# EAGLE design XTree (EAGLE 9.2.0)
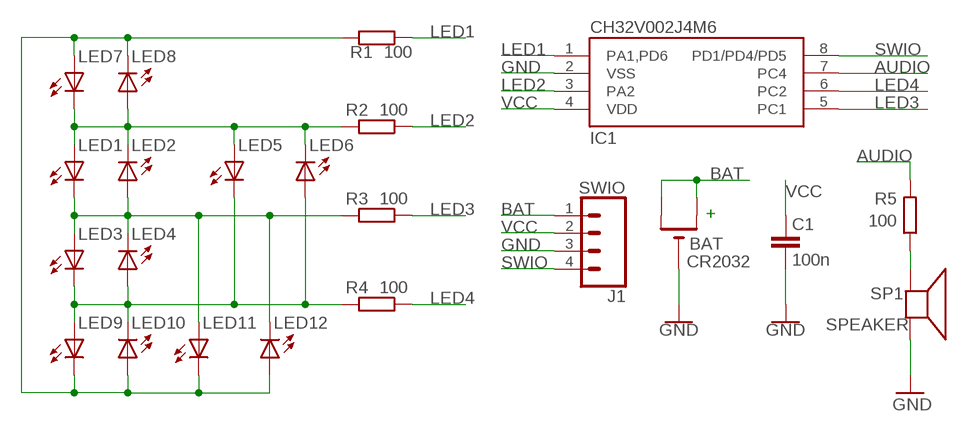
[diagram p0: schematic, sheet 1]

## Parts
BAT  CR2032  CR2032SMT  [CR2032-SMD]
C1  100n  C-EUC1206K  [C1206K]
IC1  CH32V002J4M6  CH32V003J4M6  [SOP8]
J1  SWIO  CONN_04SMD_LONG  [1X04_SMD_LONG]
LED1  LED5MM  [LED5MM]
LED2  LED5MM  [LED5MM]
LED3  LED5MM  [LED5MM]
LED4  LED5MM  [LED5MM]
LED5  LED5MM  [LED5MM]
LED6  LED5MM  [LED5MM]
LED7  LED5MM  [LED5MM]
LED8  LED5MM  [LED5MM]
LED9  LED5MM  [LED5MM]
LED10  LED5MM  [LED5MM]
LED11  LED5MM  [LED5MM]
LED12  LED5MM  [LED5MM]
R1  100  R-EU_M1206  [M1206]
R2  100  R-EU_M1206  [M1206]
R3  100  R-EU_M1206  [M1206]
R4  100  R-EU_M1206  [M1206]
R5  100  R-EU_M1206  [M1206]
SP1  SPEAKER  SPEAKERAL60P_3  [AL60P_3]

## Nets
AUDIO: IC1.7(PC4) R5.2
BAT: BAT.+$1(+) BAT.+$2(+1) J1.1
GND: BAT.- C1.2 IC1.2(VSS) J1.3 SP1.2(-)
LED1: IC1.1(PA1,PD6) R1.1
LED2: IC1.3(PA2) R2.1
LED3: IC1.5(PC1) R3.1
LED4: IC1.6(PC2) R4.1
N$2: R5.1 SP1.1(+)
N$3: LED1.A LED2.K(C) LED5.A LED6.K(C) LED7.K(C) LED8.A R2.2
N$5: LED7.A LED8.K(C) LED9.K(C) LED10.A LED11.K(C) LED12.A R1.2
N$6: LED3.K(C) LED4.A LED5.K(C) LED6.A LED9.A LED10.K(C) R4.2
N$7: LED1.K(C) LED2.A LED3.A LED4.K(C) LED11.A LED12.K(C) R3.2
SWIO: IC1.8(PD1/PD4/PD5) J1.4
VCC: C1.1 IC1.4(VDD) J1.2

## Notes on the sheet
- +

## Library data of the parts
BAT = adafruit:CR2032
C1 = rcl:C-EU: CAPACITOR, European symbol; SPICEPREFIX: C
IC1 = CH32V:CH32V003J4M6
J1 = SparkFun-Connectors:CONN_04: Multi connection point. Often used as Generic Header-pin footprint for 0.1 inch spaced/style header connections On any of the 0.1 inch spaced packages, you can populate with these: Break Away Headers - Straight <https://www.sparkfun.com/products/116> (PRT-00116) Break Away Male Headers - Right Angle <https://www.sparkfun.com/products/553> (PRT-00553) Female Headers <https://www.sparkfun.com/products/115> (PRT-00115) Break Away Headers - Machine Pin <https://www.sparkfun.com/products/117> (PRT-00117) Break Away Female Headers - Swiss Machine Pin <https://www.sparkfun.com/products/743> (PRT-00743) For SCREWTERMINALS and SPRING TERMINALS visit here: Screw Terimnals on SparkFun.com <https://www.sparkfun.com/search/results?term=Screw+Terminals> (5mm/3.5mm/2.54mm spacing) This device is also useful as a general connection point to wire up your design to another part of your project. Our various solder wires solder well into these plated through hole pads. Hook-Up Wire - Assortment (Stranded, 22 AWG) <https://www.sparkfun.com/products/11375> (PRT-11375) Hook-Up Wire - Assortment (Solid Core, 22 AWG) <https://www.sparkfun.com/products/11367> (PRT-11367) View the entire wire category on our website here <https://www.sparkfun.com/categories/141> Special notes: Molex polarized connector foot print use with SKU : PRT-08231 with associated crimp pins and housings. 1MM SMD Version SKU: PRT-10208; PROD_ID: CONN-09140; SF_ID: PRT-12638
LED1-LED12 = adafruit:LED: LED OSRAM: - CHIPLED LG R971, LG N971, LY N971, LG Q971, LY Q971, LO R971, LY R971 LH N974, LH R974 LS Q976, LO Q976, LY Q976 LO Q996 - Hyper CHIPLED LW Q18S LB Q993, LB Q99A, LB R99A - SideLED LS A670, LO A670, LY A670, LG A670, LP A670 LB A673, LV A673, LT A673, LW A673 LH A674 LY A675 LS A676, LA A676, LO A676, LY A676, LW A676 LS A679, LY A679, LG A679 - Hyper Micro SIDELED® LS Y876, LA Y876, LO Y876, LY Y876 LT Y87S - SmartLED LW L88C, LW L88S LB L89C, LB L89S, LG L890 LS L89K, LO L89K, LY L89K LS L896, LA L896, LO L896, LY L896 - TOPLED LS T670, LO T670, LY T670, LG T670, LP T670 LSG T670, LSP T670, LSY T670, LOP T670, LYG T670 LG T671, LOG T671, LSG T671 LB T673, LV T673, LT T673, LW T673 LH T674 LS T676, LA T676, LO T676, LY T676, LB T676, LH T676, LSB T676, LW T676 LB T67C, LV T67C, LT T67C, LS T67K, LO T67K, LY T67K, LW E67C LS E67B, LA E67B, LO E67B, LY E67B, LB E67C, LV E67C, LT E67C LW T67C LS T679, LY T679, LG T679 LS T770, LO T770, LY T770, LG T770, LP T770 LB T773, LV T773, LT T773, LW T773 LH T774 LS E675, LA E675, LY E675, LS T675 LS T776, LA T776, LO T776, LY T776, LB T776 LHGB T686 LT T68C, LB T68C - Hyper Mini TOPLED® LB M676 - Mini TOPLED Santana® LG M470 LS M47K, LO M47K, LY M47K Source: http://www.osram.convergy.de/
R1-R5 = rcl:R-EU_: RESISTOR, European symbol; SPICEPREFIX: R
SP1 = adafruit:SPEAKER: SPEAKER Source: Buerklin Added PS12 (for part # PS1240 piezo) http://www.ladyada.net/library/pcb/eaglelibrary.html

## Board
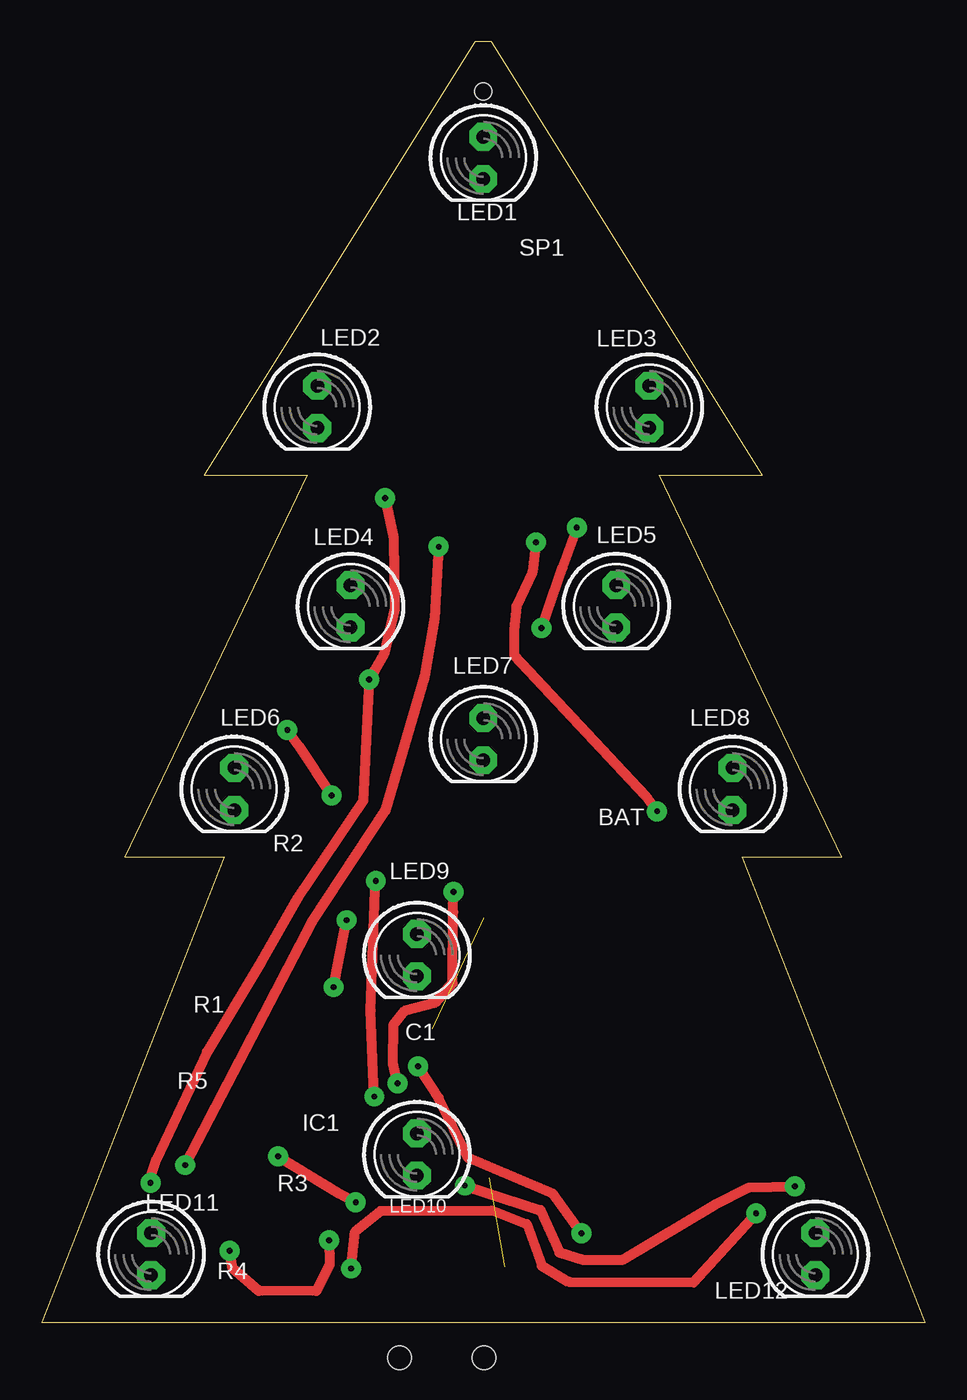
[diagram p1: board, top side]
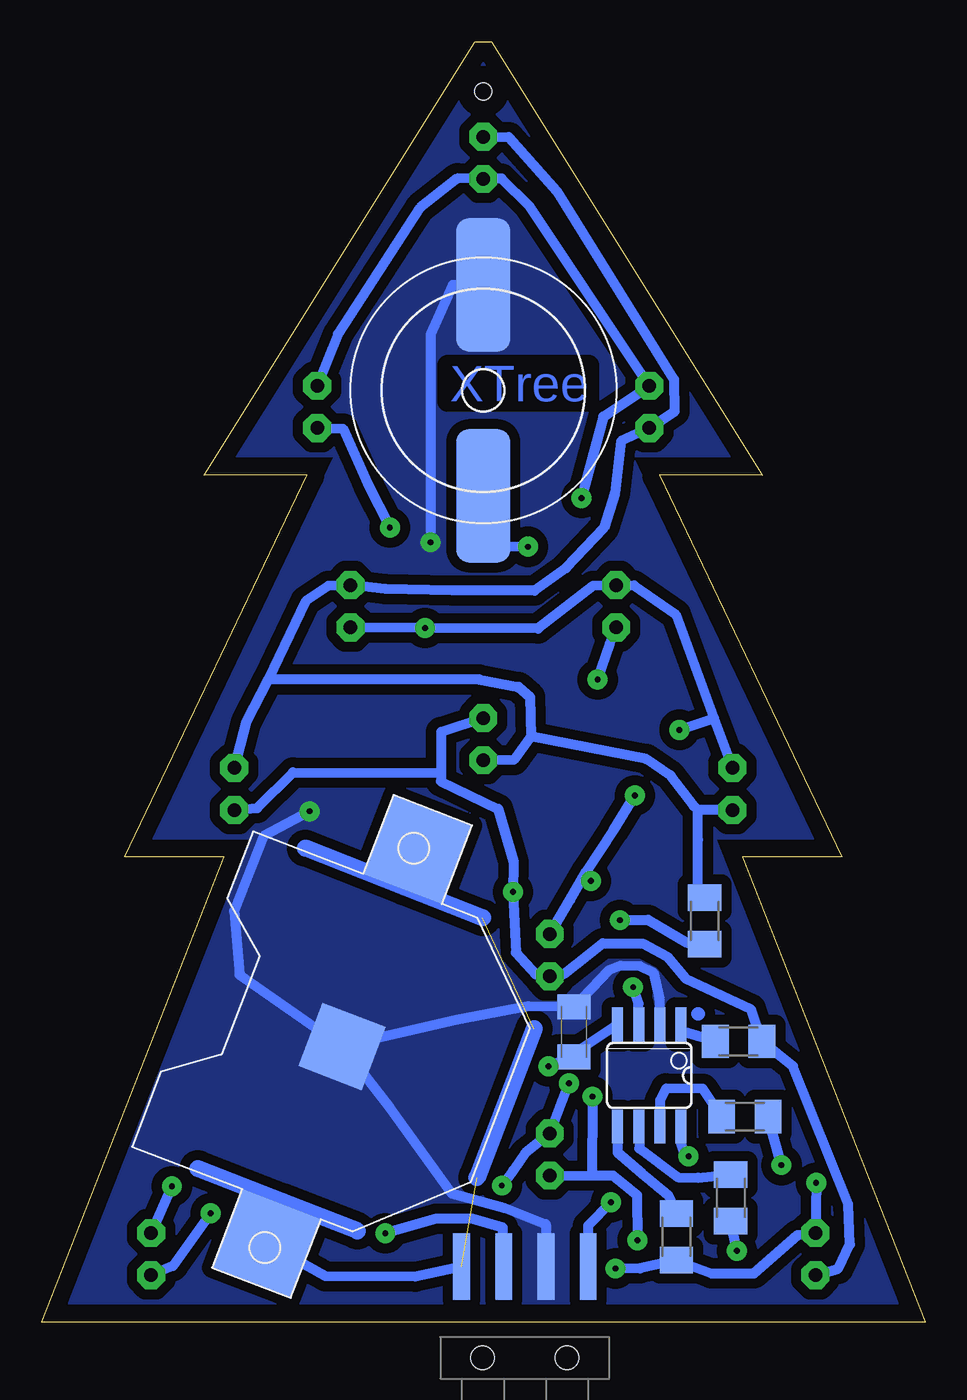
[diagram p2: board, bottom side, seen from below]

Size 53.2 x 77.1 mm. Coordinates in mm from the lower left corner, seen from the top.
Outline: 0,0 53.2,0 42.2,28 48.2,28 37.2,51 43.4,51 27.1,77.1 26.1,77.1 9.8,51 16,51 5,28 11,28 0,0
Copper layers (1*16): Top 0.035mm / dielectric 1.5mm / Bottom 0.035mm
Design rules "default": minimum track width 6mil, minimum drill 0.35mm, track to track 6mil, track to pad 6mil, pad to pad 6mil, via to via 6mil, smd to smd 6mil, copper to edge 40mil, drill to drill 6mil, minimum pad ring 10mil, minimum via ring 8mil, stop-mask expansion 4mil, vias tented up to drill 0mil, thermal gap 10mil
Holes 1 mm at 26.6,74.1

### Footprints (pad centres in the part's own frame; a part is rotated, then mirrored left to right if it is on the bottom)
CR2032-SMD = smd 5.08 x 5.08: +$1 -12.7,0; +$2 12.7,0 | smd 4.064 x 4.064: - 0,0
C1206K = smd 1.5 x 2: 1 -1.5,0; 2 1.5,0
SOP8 = smd 0.66 x 2.032: 1 -1.905,-3.073; 2 -0.635,-3.073; 3 0.635,-3.073; 4 1.905,-3.073; 5 1.905,3.073; 6 0.635,3.073; 7 -0.635,3.073; 8 -1.905,3.073
1X04_SMD_LONG = smd 1 x 4: 1 -3.81,5.5; 2 -1.27,5.5; 3 1.27,5.5; 4 3.81,5.5 | hole 1.4: -2.54,0; 2.54,0
LED5MM = drill 0.813 pad 1.676 octagon: A -1.27,0; K 1.27,0
M1206 = smd 1.6 x 2: 1 -1.4,0; 2 1.4,0
AL60P_3 = smd 8 x 3.251: 1 -6.35,0; 2 6.35,0

### Placement (x,y rotation side)
BAT  35.1,16.6 69 bottom
C1  21.14,17.48 90 bottom
IC1  16.61,14.86 180 bottom
J1  24.1,-2.15 0 bottom
LED1  26.6,70.1 270 top
LED2  16.6,55.1 270 top
LED3  36.6,55.1 270 top
LED4  18.6,43.1 270 top
LED5  34.6,43.1 270 top
LED6  11.6,32.1 270 top
LED7  26.6,35.1 270 top
LED8  41.6,32.1 270 top
LED9  22.6,22.1 270 top
LED10  22.6,10.1 270 top
LED11  6.6,4.1 270 top
LED12  46.6,4.1 270 top
R1  11.23,16.9 0 bottom
R2  13.27,24.15 90 bottom
R3  14.97,5.14 270 bottom
R4  11.7,7.49 270 bottom
R5  10.86,12.38 180 bottom
SP1  26.6,56.1 90 bottom

### Tracks (layer width: path | path; a pad name or v marks a point on that pad's centre or on a via)
AUDIO
  Bottom 0.61: R5.2 13.38,14.06 15.6,14.07 15.95,13.36 IC1.7
BAT  (2 unrouted)
  Bottom 0.61: J1.1 30.7,2.75 36.11,2.77 BAT.+$1
  Bottom 1.016: 34.18,5.5 38.68,7.26 | 38.68,7.26 43.77,9.25 | 26.64,24.35 31.33,26.19 | 31.33,26.19 37.32,28.55 | 23.54,17.67 26.99,8.7 | 38.68,7.26 BAT.+$1 | BAT.+$2 31.33,26.19
GND  (via drill 0.35 pad 1.2)
  Top 0.61: v29.78,46.95 29.55,45.15 28.59,43.11 28.45,41.67 28.45,40.18 36.35,31.71 v37.07,30.76
  Bottom 0.61: SP1.2 28.45,62.44 29.77,59.47 v29.78,46.95 | BAT.- 32.27,12.97 28.5,7.76 25.33,6.89 22.84,5.91 J1.3 | v37.07,30.76 39.83,29.27 41.62,24.76 41.28,20.91 BAT.- | IC1.2 16.01,19.47 16.37,21.06 17.16,21.44 18.34,21.47 19.03,21.2 C1.2 23.91,19.02 28.17,18.21 BAT.-
  pour Bottom (isolate 0.61, no thermals): 1.6,1.1 12.6,29.1 6.6,29.1 17.6,52.1 11.6,52.1 26.6,76.1 41.6,52.1 35.6,52.1 46.6,29.1 40.6,29.1 51.6,1.1
LED1
  Bottom 0.508: 14.57,17.48 IC1.1
  Bottom 0.61: R1.1 14.57,17.48
LED2  (via drill 0.35 pad 1.2)
  Top 0.61: v17.58,20.17 17.78,21.28 v18.37,24.21
  Bottom 0.61: IC1.3 17.26,19.19 v17.58,20.17 | v18.37,24.21 16.67,24.22 14.31,22.85 R2.1
LED3
  Bottom 0.61: IC1.5 18.52,10.22 17.06,8.96 15.48,7.67 R3.1
LED4
  Bottom 0.61: IC1.6 17.21,10.46 14.89,8.73 13.68,8.71 R4.1
N$2  (via drill 0.35 pad 1.2)
  Top 0.61: v23.92,46.69 23.67,42.39 23.06,38.9 20.69,30.78 16.27,24.07 v8.65,9.46
  Bottom 0.61: SP1.1 26.21,46.72 v23.92,46.69 | v8.65,9.46 R5.1
N$3
  Bottom 0.61: LED1.A 25.06,71.35 22.18,68.1 15.12,56.75 15.09,54.84 LED2.K 18.31,53.03 18.68,49.9 19.34,47.81 21.62,45.39 23.51,44.05 28.48,44.05 32.5,44.14 LED5.A 35.94,44.33 37.3,43.41 39.57,38.68 | 39.57,38.68 40.87,36.15 LED8.A | 23.73,35.25 23.78,37.63 24.47,38.25 26.86,38.7 33.13,38.71 39.57,38.68 | 23.73,35.25 24.76,33.86 LED7.K | LED6.K 13.69,30.83 | 13.69,30.83 13.94,31.08 15.33,32.92 16.79,33.9 23.73,35.25 | R2.2 13.69,26.03 13.67,29.05 13.69,30.83
N$5  (via drill 0.35 pad 1.2)
  Top 0.61: v25.49,8.23 30.04,6.75 31.18,4.2 32.64,3.75 34.97,3.75 40.57,7.11 42.6,8.11 v45.35,8.18 | v21.43,14.38 21.16,15.6 21.18,17.9 21.89,18.76 23.73,19.26 24.76,20.42 24.78,24.69 v24.81,25.91
  Bottom 0.61: LED8.K 40.21,30.96 38.05,33.1 29.15,33.07 | LED7.A 29.14,35.54 29.15,33.07 | 29.15,33.07 29.15,32.56 25.71,30.91 24.78,27.7 24.82,25.83 | 24.82,25.83 24.64,22.25 23.4,20.92 LED9.K 21.74,20.97 19.43,22.82 16.99,22.79 15.54,22.02 14.42,20.69 10.51,18.86 R1.2 7.95,15.41 4.63,7.11 4.53,4.68 5.24,3.23 LED11.K | v25.49,8.23 24.79,9.16 24.07,10.19 LED10.A 21.84,13.35 v21.43,14.38 | v45.35,8.18 LED12.A | v24.81,25.91 24.82,25.83
N$6  (via drill 0.35 pad 1.2)
  Top 0.61: v32.23,47.83 31.37,45.45 v30.1,41.8 | v17.46,31.72 15.52,34.66 v14.8,35.66 | v17.32,4.93 17.35,3.47 16.54,1.88 13.09,1.89 11.52,3.25 v11.32,4.31 | v20.04,13.58 19.82,18.77 20.08,26 v20.13,26.56
  Bottom 0.61: LED3.K 35.05,53.79 33.56,50.48 v32.23,47.83 | 30.32,41.78 23.3,41.75 19.99,44.33 LED4.A 17.52,44.36 15.02,42.6 12.71,36.36 | 30.32,41.78 LED5.K | 12.71,36.36 LED6.A | v30.1,41.8 30.32,41.78 | LED9.A 21.37,25.42 20.38,27.14 | 20.38,27.14 18.75,29.62 v17.46,31.72 | v14.8,35.66 12.71,36.36 | LED10.K 20.03,8.84 | 20.03,8.84 20.18,8.84 18.79,8.84 17.34,7.67 v17.32,4.93 | v11.32,4.31 R4.2 | 20.03,8.84 20,13.37 v20.04,13.58 | v20.13,26.56 20.38,27.14
N$7  (via drill 0.35 pad 1.2)
  Top 0.508: 6.45,8.42 v6.56,8.39
  Top 0.61: v20.68,49.62 21.2,47.2 21.27,42.94 20.62,40.23 20.05,39.24 v19.72,38.7 19.37,31.38 15.43,25.53 13.23,21.68 9.97,16.28 6.89,9.77 6.45,8.42 | v18.64,3.23 18.89,5.47 20.4,6.71 27.12,6.72 29.22,5.91 30.12,3.4 31.74,2.45 39.26,2.4 v43.03,6.56
  Bottom 0.61: LED3.A 35.36,59.49 30.4,67.09 28.15,68.87 LED1.K 25.5,68.85 23.81,67.18 LED2.A 19.38,54.53 v20.68,49.62 | v19.72,38.7 18.98,40.86 LED4.K | v18.64,3.23 17.16,3.25 R3.2 12.86,2.94 10.3,2.94 7.67,5.25 LED11.A v6.56,8.39 | v43.03,6.56 45.28,3.4 LED12.K
SWIO  (via drill 0.35 pad 1.2)
  Top 0.61: v14.24,9.98 17.91,7.76 v18.92,7.22
  Bottom 0.508: 14.41,9.87 v14.24,9.98
  Bottom 0.61: J1.4 20.29,5.81 v18.92,7.22 | IC1.8 14.7,10.76 14.41,9.87
VCC  (via drill 0.35 pad 1.2)
  Top 0.61: v32.5,5.35 30.8,7.73 25.68,9.89 23.91,13.52 v22.68,15.41
  Bottom 0.508: 20.6,16.53 20.79,15.67 C1.1
  Bottom 0.61: J1.2 25.43,5.69 27.28,6.24 29.45,6.24 v32.5,5.35 | v22.68,15.41 22.07,15.66 20.79,15.67 | 20.6,16.53 IC1.4
(copper drawn outside any net)
  shapes: Bottom circle x1

### Text on the board
Bottom: XTree
Document: BAT | SWIO | GND | VCC